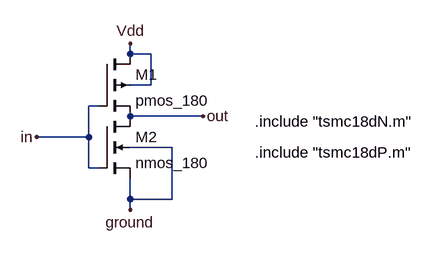
[diagram p0: schematic CMOS_NOT.asc]
CMOS_NOT.asc, the LTspice schematic file:
Version 4.1
SHEET 1 2184 1656
WIRE 944 720 944 704
WIRE 976 720 944 720
WIRE 976 768 976 720
WIRE 976 768 944 768
WIRE 896 800 880 800
WIRE 1056 816 944 816
WIRE 880 848 880 800
WIRE 880 848 800 848
WIRE 1008 864 944 864
WIRE 880 896 880 848
WIRE 896 896 880 896
WIRE 944 944 944 912
WIRE 1008 944 1008 864
WIRE 1008 944 944 944
WIRE 944 960 944 944
FLAG 1056 816 out
FLAG 944 704 Vdd
FLAG 944 960 ground
FLAG 800 848 in
SYMBOL pmos4 896 720 R0
SYMATTR InstName M1
SYMATTR Value pmos_180
SYMATTR Value2 l=180n w=1u
SYMBOL nmos4 896 816 R0
SYMATTR InstName M2
SYMATTR Value nmos_180
SYMATTR Value2 l=180n w=1u
TEXT 1136 824 Left 2 !.include "tsmc18dN.m"
TEXT 1136 872 Left 2 !.include "tsmc18dP.m"

The netlist it stands for:
* CMOS_NOT.asc
M1 Vdd in out Vdd pmos_180 l=180n w=1u
M2 out in ground ground nmos_180 l=180n w=1u
.model NMOS NMOS
.model PMOS PMOS
.lib standard.mos
.include "tsmc18dN.m"
.include "tsmc18dP.m"
.backanno
.end